# EAGLE design 0228-carrier-pos-neg-boost (EAGLE 9.6.2)
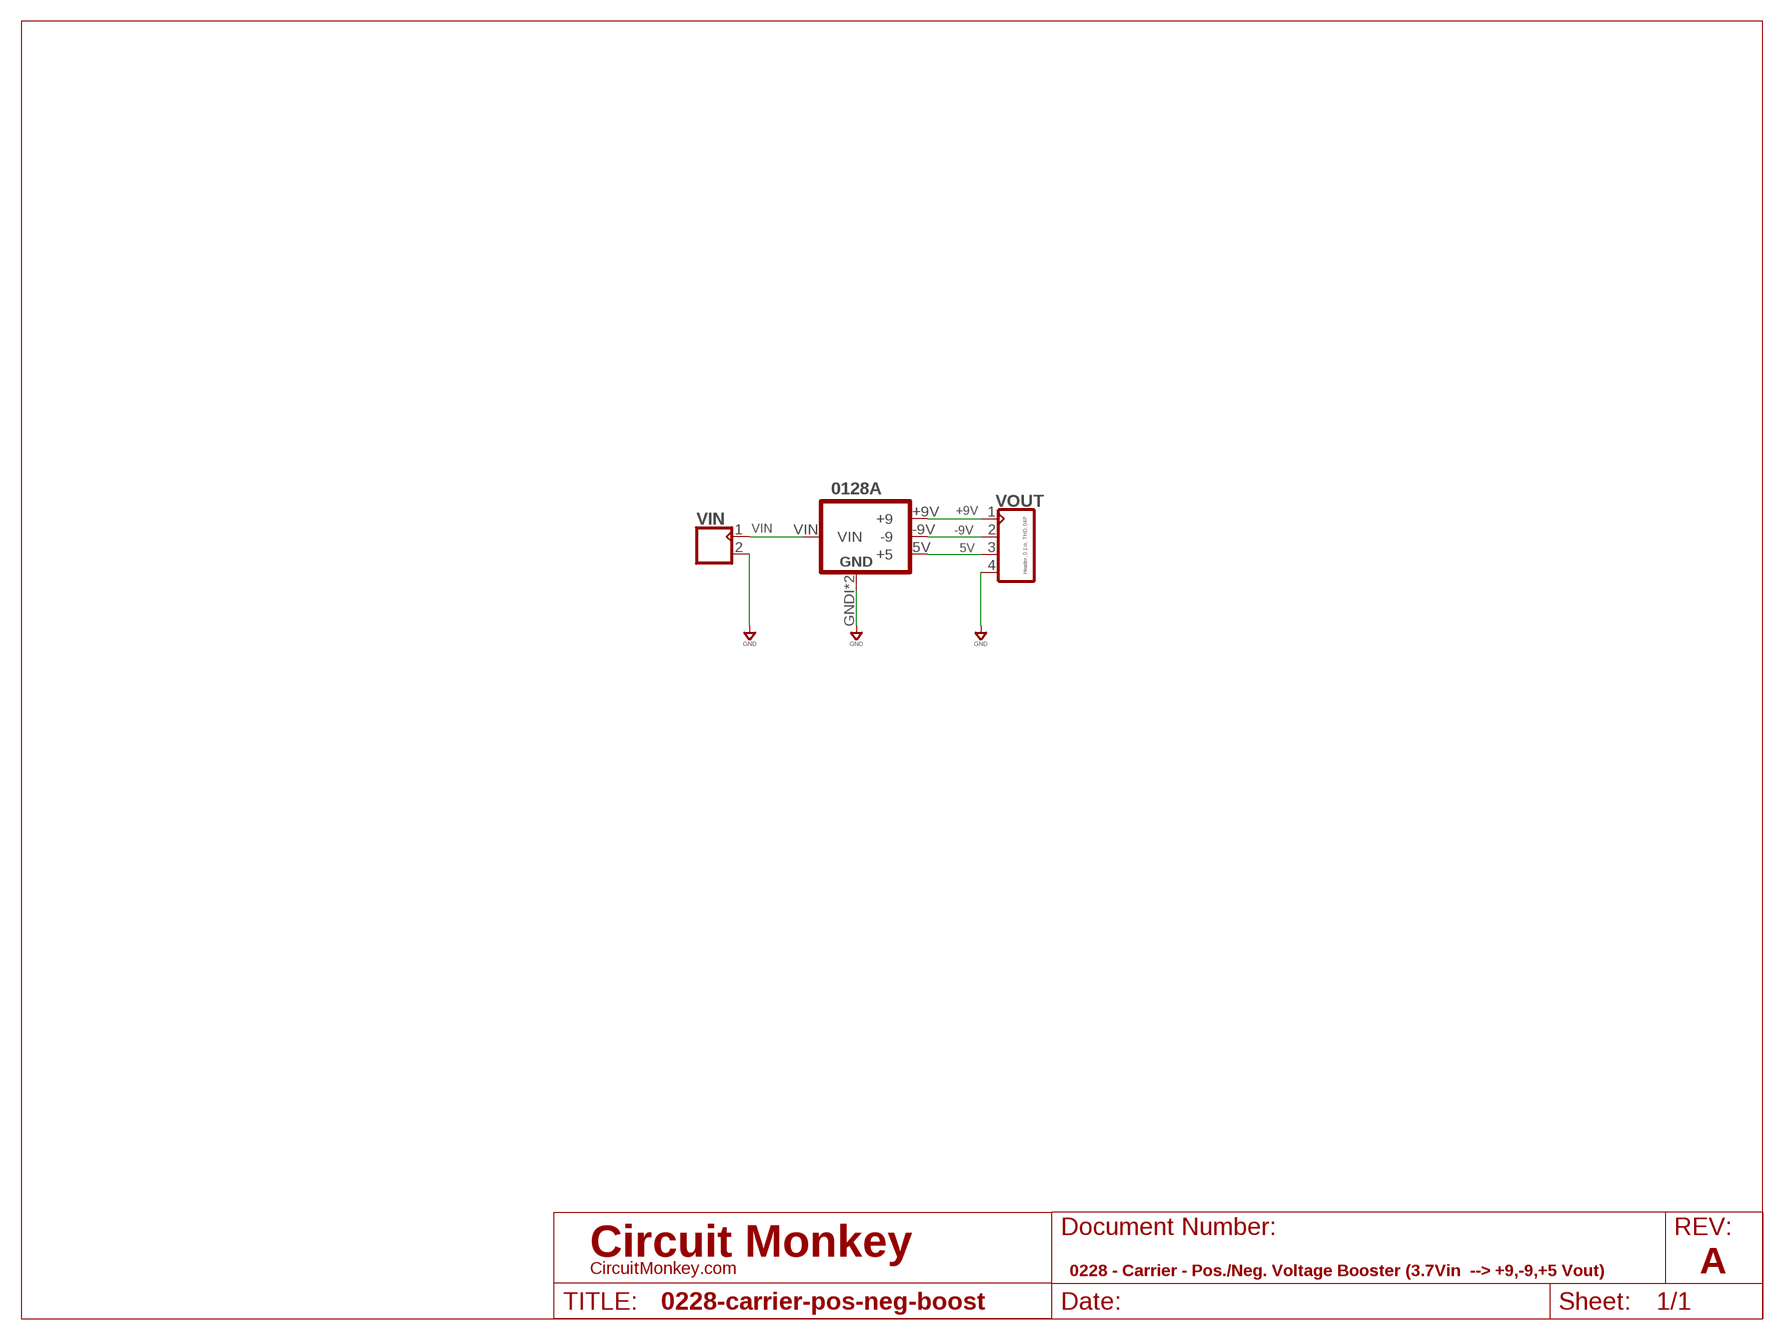
[diagram p0: schematic, sheet 1]
SHEET1 (LETTER_L-CIRCUITMONKEY): DOCUMENT_NUMBER: 0228 - Carrier - Pos./Neg. Voltage Booster (3.7Vin --> +9,-9,+5 Vout); REV: A

## Parts
0128A  0128REV-A  [1028A]
VIN  CON_02X1-2.54MM-THD-VT  [MA02X1-VT-THD]
VOUT  Header, 0.1in, THD, 04P  CON_04X1-THD-VT  [MA04X1-VT-THD]

## Nets
5V: 0128A.5V(+5) VOUT.3
+9V: 0128A.+9V(+9) VOUT.1
-9V: 0128A.-9V(-9) VOUT.2
GND: 0128A.GNDI(GND) 0128A.GNDO(GND) VIN.2 VOUT.4
VIN: 0128A.VIN VIN.1

## Library data of the parts
0128A = circuit-monkey-chips:0128: 0128 - Pos/Neg Voltage Booster, 3.7V in, -9,+9,+5 out.
VIN = con-headers:CON_02X1: Connector, 2P
VOUT = con-headers:CON_04X1: Headers, 04 pin; MFR: Molex; MPN: 022284043

## Board
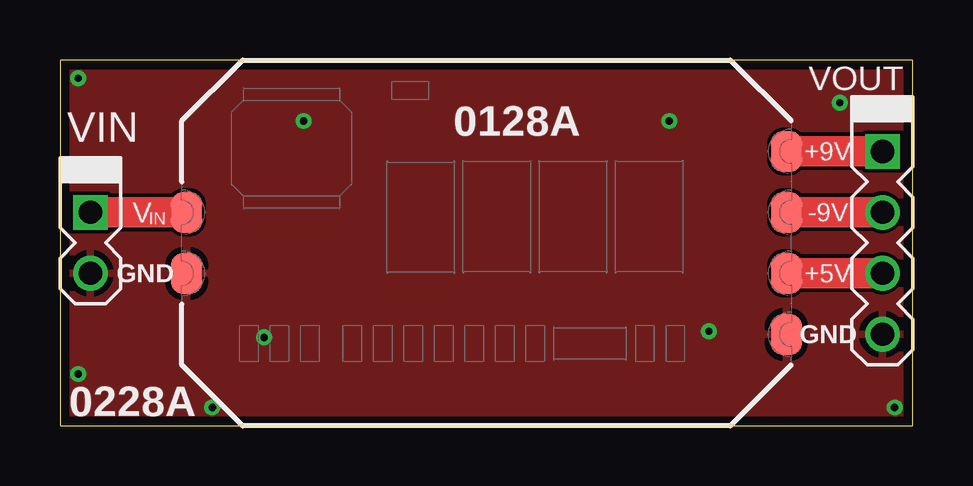
[diagram p1: board, top side]
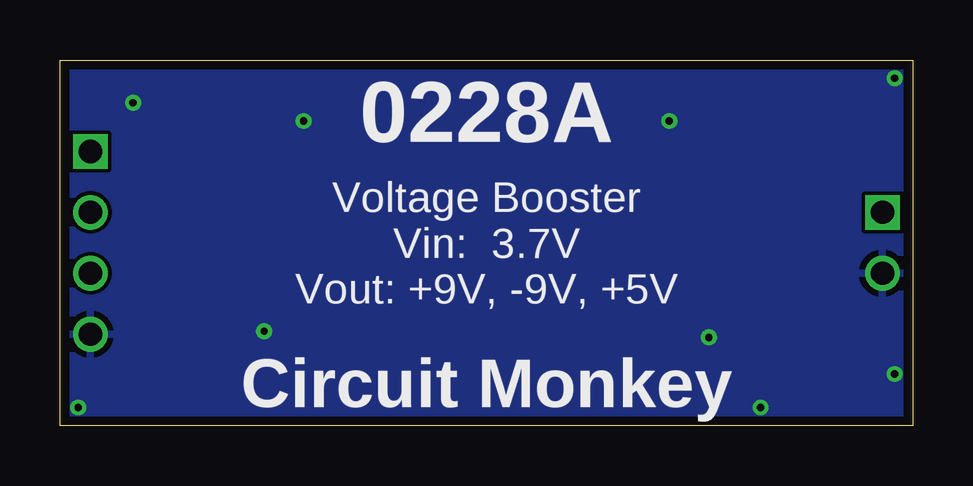
[diagram p2: board, bottom side, seen from below]

Size 35.56 x 15.24 mm. Coordinates in mm from the lower left corner, seen from the top.
Outline: 0,0 35.56,0 35.56,15.24 0,15.24 0,0
Copper layers (1*16): Top 0.0356mm / dielectric 1.5011mm / Bottom 0.0356mm
Design rules "OSH-CircuitMonkey": minimum track width 6mil, minimum drill 12mil, track to track 6mil, track to pad 6mil, pad to pad 6mil, via to via 6mil, smd to smd 6mil, copper to edge 15mil, drill to drill 6mil, minimum pad ring 7mil, minimum via ring 7mil, stop-mask expansion 3mil, vias tented up to drill 13mil, thermal gap 10mil

### Footprints (pad centres in the part's own frame; a part is rotated, then mirrored left to right if it is on the bottom)
1028A = smd 1.3 x 1.7: 5V 12.5,-1.27; +9V 12.5,3.81; -9V 12.5,1.27; GNDI -12.5,-1.27; GNDO 12.5,-3.81; VIN -12.5,1.27
MA02X1-VT-THD = drill 0.965 square: 1 -1.27,0 | drill 0.965: 2 1.27,0
MA04X1-VT-THD = drill 0.965 square: 1 -3.81,0 | drill 0.965: 2 -1.27,0; 3 1.27,0; 4 3.81,0

### Placement (x,y rotation side)
0128A  17.78,7.62 0 top
VIN  1.27,7.62 270 top
VOUT  34.29,7.62 270 top

### Tracks (layer width: path | path; a pad name or v marks a point on that pad's centre or on a via)
5V
  Top 1.27: VOUT.3 0128A.5V
+9V
  Top 1.27: VOUT.1 0128A.+9V
-9V
  Top 1.27: VOUT.2 0128A.-9V
GND  (via drill 0.3)
  other vias: 34.8,0.76 32.51,13.46 0.76,14.48 0.76,2.16 6.35,0.76 25.4,12.7 10.16,12.7 27.05,3.94 8.51,3.68
  pour Top: 0,0 0,15.24 35.56,15.24 35.56,0
  pour Bottom: 35.56,0 35.56,15.24 0,15.24 0,0
VIN
  Top 1.27: VIN.1 0128A.VIN

### Text on the board
tPlace: 0228A
bPlace: 0228A | Voltage Booster / Vin: 3.7V / Vout: +9V, -9V, +5V | Circuit Monkey